# Altium schematic sheet schematics.SchDoc: RF & LDO
size A4; Organization: Laboratoire de Systèmes Robootiques; Address1: Philippe Retornaz; Address2: STI-IMT-LSRO1; Address3: EPFL; Address4: CH-1015 LAUSANNE; DocumentNumber: Init DocumentNumber in DocParam; Revision: A; SheetNumber: 1; SheetTotal: 1; ApprovedBy: Init ApprovedBy in DocParam; CheckedBy: Init CheckedBy in DocParam; Author: Init Author in DocParam; CompanyName: Init CompanyName in DocParam; DrawnBy: Init DrawBy in DocParam; Engineer: Init Engineer in DocParam; DocumentName: Init DocumentName in DocParam; ProjectName: Init ProjectName in DocParam
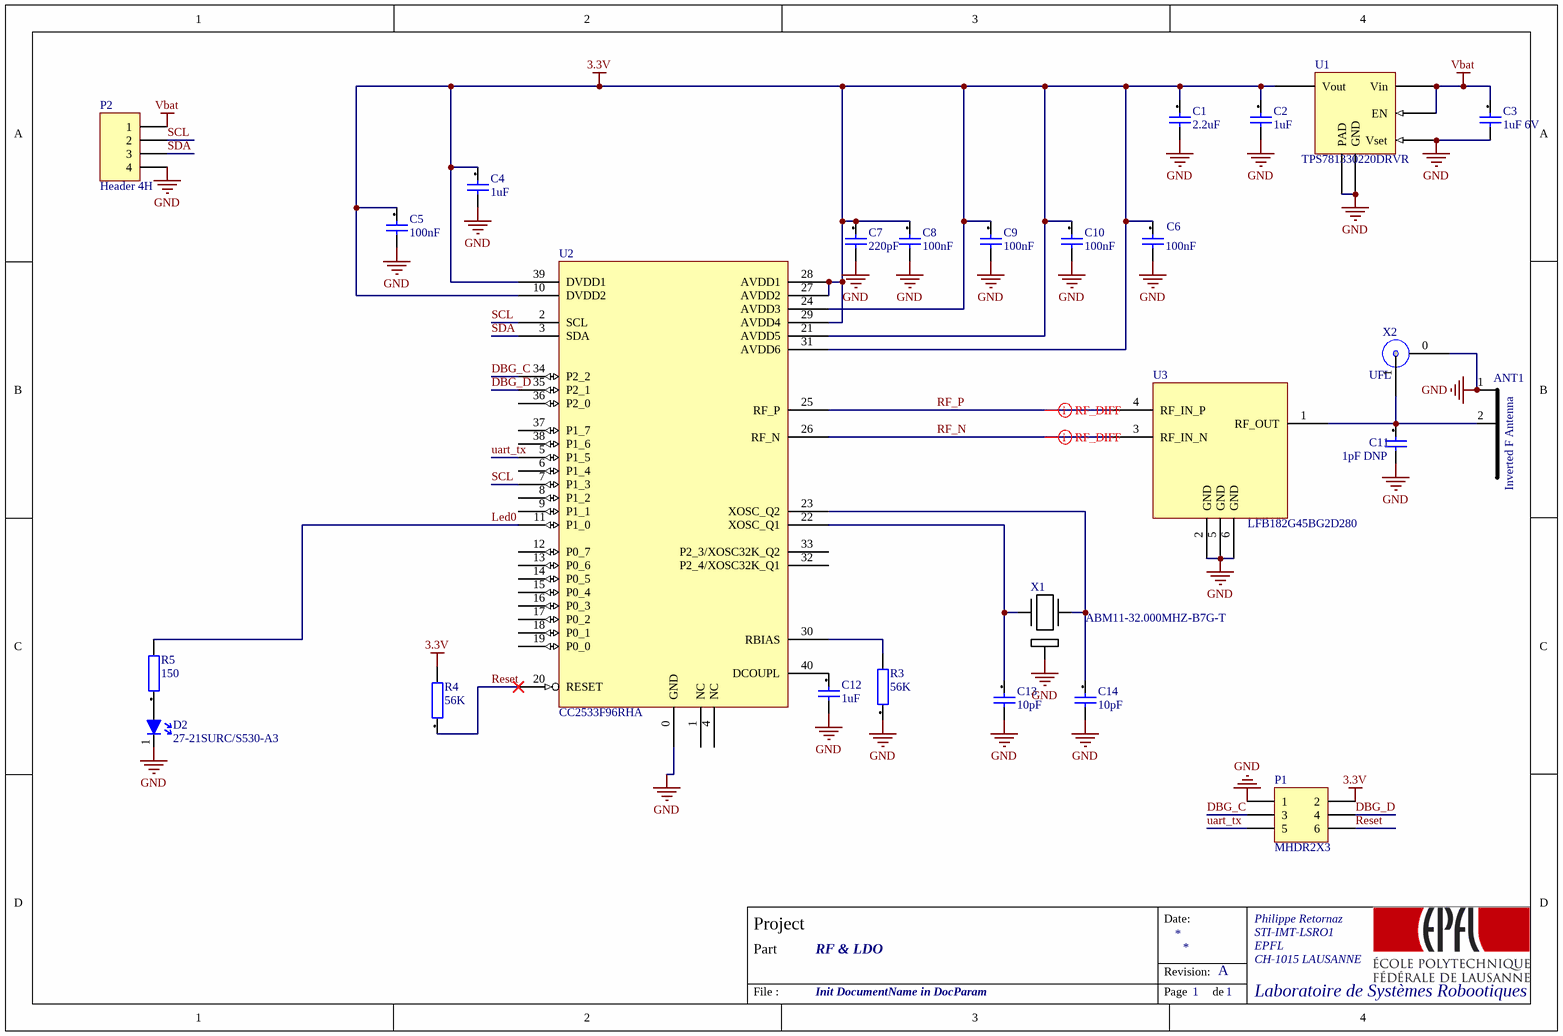
[diagram p0: schematics.SchDoc]

## Parts
ANT1  Inverted F Antenna  [IFA_2]  (net tie, no BOM)
C1  2.2uF  [CAPC1005X05L]
C2  1uF  [CAPC1005X05L]
C3  1uF 6V  [CAPC1005X05L]
C4  1uF  [CAPC1005X05L]
C5  100nF  [CAPC1005X05L]
C6  100nF  [CAPC1005X05L]
C7  220pF  [CAPC1005X05L]
C8  100nF  [CAPC1005X05L]
C9  100nF  [CAPC1005X05L]
C10  100nF  [CAPC1005X05L]
C11  1pF DNP  [CAPC1005X05L]
C12  1uF  [CAPC1005X05L]
C13  10pF  [CAPC1005X05L]
C14  10pF  [CAPC1005X05L]
D2  27-21SURC/S530-A3  [Led-side]
P1  MHDR2X3  [MHDR2X3]
P2  Header 4H  [HDR1X4H]
R3  56K  [RESC1005X04L]
R4  56K  [RESC1005X04L]
R5  150  [RESC1005X04L]
U1  TPS781330220DRVR  [QFN65P200X200X80-6N]
U2  CC2533F96RHA  [QFN50P600X600X100-40L-2]
U3  LFB182G45BG2D280  [LFB182G45BG2D280]
X1  ABM11-32.000MHZ-B7G-T  [Abracon-ABM11]
X2  UFL  [U.FL-R-SMT-1]

## Nets
3.3V: C1.1 C2.1 C4.1 C5.1 C6.1 C7.1 C8.1 C9.1 C10.1 P1.2 R4.2 U1.5(Vout) U2.10(DVDD2) U2.21(AVDD5) U2.24(AVDD3) U2.27(AVDD2) U2.28(AVDD1) U2.29(AVDD4) U2.31(AVDD6) U2.39(DVDD1)
GND: ANT1.1(GND) C1.2 C2.2 C3.2 C4.2 C5.2 C6.2 C7.2 C8.2 C9.2 C10.2 C11.2 C12.2 C13.2 C14.2 D2.1(K) P1.1 P2.4 R3.1 U1.3(Vset) U1.4(GND) U1.7(PAD) U2.0(GND) U3.2(GND) U3.5(GND) U3.6(GND) X1.0(GND) X2.0(NC)
Vbat: C3.1 P2.1 U1.1(Vin) U1.2(EN)
DBG_C: P1.3 U2.34(P2_2)
DBG_D: P1.4 U2.35(P2_1)
Led0: R5.2 U2.11(P1_0)
Reset: P1.6 R4.1 U2.20(RESET)
RF_N: U2.26(RF_N) U3.3(RF_IN_N)
RF_P: U2.25(RF_P) U3.4(RF_IN_P)
SCL: P2.2 U2.2(SCL) U2.7(P1_3)
SDA: P2.3 U2.3(SDA)
uart_tx: P1.5 U2.5(P1_5)
NetANT1_2: ANT1.2(Input) C11.1 U3.1(RF_OUT) X2.1
NetC12_1: C12.1 U2.40(DCOUPL)
NetC13_1: C13.1 U2.22(XOSC_Q1) X1.1
NetC14_1: C14.1 U2.23(XOSC_Q2) X1.2
NetD2_2: D2.2(A) R5.1
NetR3_2: R3.2 U2.30(RBIAS)

Not connected (* = marked no-connect by the designer): U2 1(NC) 4(NC) 6(P1_4) 8(P1_2) 9(P1_1) 12(P0_7) 13(P0_6) 14(P0_5) 15(P0_4) 16(P0_3) 17(P0_2) 18(P0_1) 19(P0_0) 32(P2_4/XOSC32K_Q1) 33(P2_3/XOSC32K_Q2) 36(P2_0) 37(P1_7) 38(P1_6)

## Layout directives
differential pair: RF_N, RF_P

## Notes on the sheet
- Date:
- Project
- Part
- Revision:
- File :
- Page
- de

## Library data of the parts
ANT1 = PIF_Antenna: pin to pad: 1>2 2>1
C1 = 220nF[[/\]]0603[[/\]]1: Capacitor; Manufacturer: Epcos; Manufacturer Nr: B37931K0224K60; Preference: 1; Tolerance +: +10; Tolerance -: -10; Dielectric: X7R; Voltage: 25; MaxTemperature: +125; MinTemperature: -55; Quant_1: 10; Quant_2: 50; Quant_3: 100; Quant_4: 500; Quant_5: 1000; Currentie: CHF; Size: 0603; Footprint Acort: 0603_G; Supplier: Farnell; Supplier Nr: 8805644; ComponentLink2Description: Farnell link; ComponentLink2URL: http://ch.farnell.com/jsp/displayProduct.jsp?sku=8805644; Price_1: 0.092; Price_2: 0.082; Price_3: 0.071; Price_4: 0.061; Price_5: 0.051; ROHS: True; DateLastUpdate: 2007-12-03 / 14:22:49
C2-C4 C12 = 1uF[[/\]]0402[[/\]]1: Capacitor; Manufacturer: Kemet; Manufacturer Nr: C0402C105K9PAC; Preference: 1; Tolerance +: +10; Tolerance -: -10; Dielectric: X5R; Voltage: 6.3; MaxTemperature: +85; MinTemperature: -55; Quant_1: 10; Quant_2: 100; Quant_3: 1000; Quant_4: 4000; Currentie: CHF; Size: 0402; Footprint Acort: 0402; Supplier: Farnell; Supplier Nr: 1288253; ComponentLink2Description: Farnell link; ComponentLink2URL: http://ch.farnell.com/jsp/displayProduct.jsp?sku=1288253; Price_1: 0.11; Price_2: 0.089; Price_3: 0.078; Price_4: 0.068; ROHS: True; DateLastUpdate: 2007-12-03 / 14:22:43
C5-C10 = 100nF[[/\]]0402[[/\]]1: Capacitor; Manufacturer: Kemet; Manufacturer Nr: C0402C104K4RAC; Preference: 1; Tolerance +: +10; Tolerance -: -10; Dielectric: X7R; Voltage: 16; MaxTemperature: +125; MinTemperature: -55; Quant_1: 10; Quant_2: 100; Quant_3: 1000; Quant_4: 4000; Currentie: CHF; Size: 0402; Footprint Acort: 0402; Supplier: Farnell; Supplier Nr: 1288252; ComponentLink2Description: Farnell link; ComponentLink2URL: http://ch.farnell.com/jsp/displayProduct.jsp?sku=1288252; Price_1: 0.047; Price_2: 0.041; Price_3: 0.038; Price_4: 0.037; ROHS: True; DateLastUpdate: 2007-12-03 / 14:22:29
C11 C13 C14 = 15pF[[/\]]0402[[/\]]1: Capacitor; Manufacturer: Murata; Manufacturer Nr: GRM1555C1H150JZ01D; Preference: 1; Tolerance +: +5; Tolerance -: -5; Dielectric: CGO; Voltage: 50; MaxTemperature: +125; MinTemperature: -55; Quant_1: 10; Quant_2: 100; Quant_3: 500; Quant_4: 1000; Quant_5: 4000; Quant_6: 8000; Currentie: CHF; Size: 0402; Footprint Acort: 0402; Supplier: Farnell; Supplier Nr: 8819599; ComponentLink2Description: Farnell link; ComponentLink2URL: http://ch.farnell.com/jsp/displayProduct.jsp?sku=8819599; Price_1: 0.071; Price_2: 0.061; Price_3: 0.051; Price_4: 0.041; Price_5: 0.031; Price_6: 0.02; ROHS: True; DateLastUpdate: 2007-12-03 / 14:22:37
D2 = LED: SMD Red led right angle mount 2V@20ma 57mcd; VerifiedComment: ToDo; LayerSch: Top
P1 = MHDR2X3: Header, 3-Pin, Dual row; LatestRevisionDate: 17-Jul-2002; LatestRevisionNote: Re-released for DXP Platform.; Publisher: Altium Limited
P2 = Header 4H: Header, 4-Pin, Right Angle; LatestRevisionDate: 17-Jul-2002; LatestRevisionNote: Re-released for DXP Platform.; Publisher: Altium Limited
R3-R5 = 0R[[/\]]0402[[/\]]1: Resistor; Manufacturer: Phycomp; Manufacturer Nr: 232270591001; Tolerance: +/-1; Preference: 1; Power: 0.063; Voltage: 50; ppm/K: +/-200; Quant_2: 1000; Quant_3: 5000; Quant_4: 15000; Currentie: CHF; Size: 0402; Footprint Acort: 0402; Supplier: Farnell; Supplier Nr: 9232516; ComponentLink2Description: Farnell link; ComponentLink2URL: http://ch.farnell.com/jsp/displayProduct.jsp?sku=9232516; Current: 1; ROHS: True; Quant_1: 50; Price_1: 0.112; Price_2: 0.082; Price_3: 0.071; Price_4: 0.061; DateLastUpdate: 2007-11-29 / 09:12:23
U1 = TPS781: 150mA LDO TI; pin to pad: 1>6 2>4 4>5 5>1
U2 = cc2533: A True System-on-Chip Solution for 2.4-GHz IEEE 802.15.4
U3 = 2450BM15A0002: Balun for CC253x
X1 = ABM11-32.000MHZ-B7G-T: 32Mhz Crystal, 15ppm
X2 = U.FL-R-SMT-1